# Altium schematic sheet FAN.SchDoc
size A; SheetNumber: 6; SheetTotal: 8
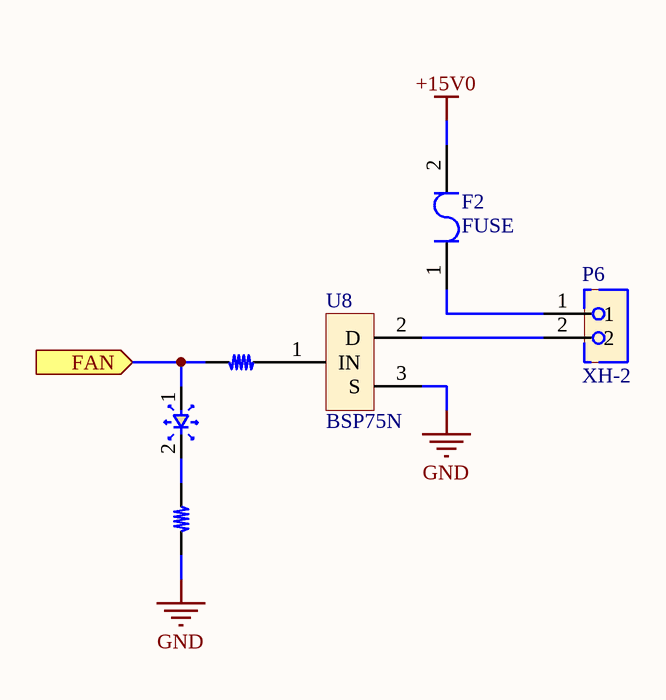
[diagram p0: FAN.SchDoc]

## Parts
D20  LED_SMD  [D 0603]  (value not drawn)
F2  FUSE  [F 1812]
P6  XH-2  [XH-2]
R51  RES_SMD  [R 0603]  (value not drawn)
R52  RES_SMD  [R 0603]  (value not drawn)
U8  BSP75N  [SOT-223 - BSP75N]

## Ports
FAN (in)

## Nets
+15V0: F2.2
GND: R52.2 U8.3(S)
FAN: D20.1 R51.2 ; port FAN
NetD20_2: D20.2 R52.1
NetF2_1: F2.1 P6.1
NetP6_2: P6.2 U8.2(D)
NetR51_1: R51.1 U8.1(IN)